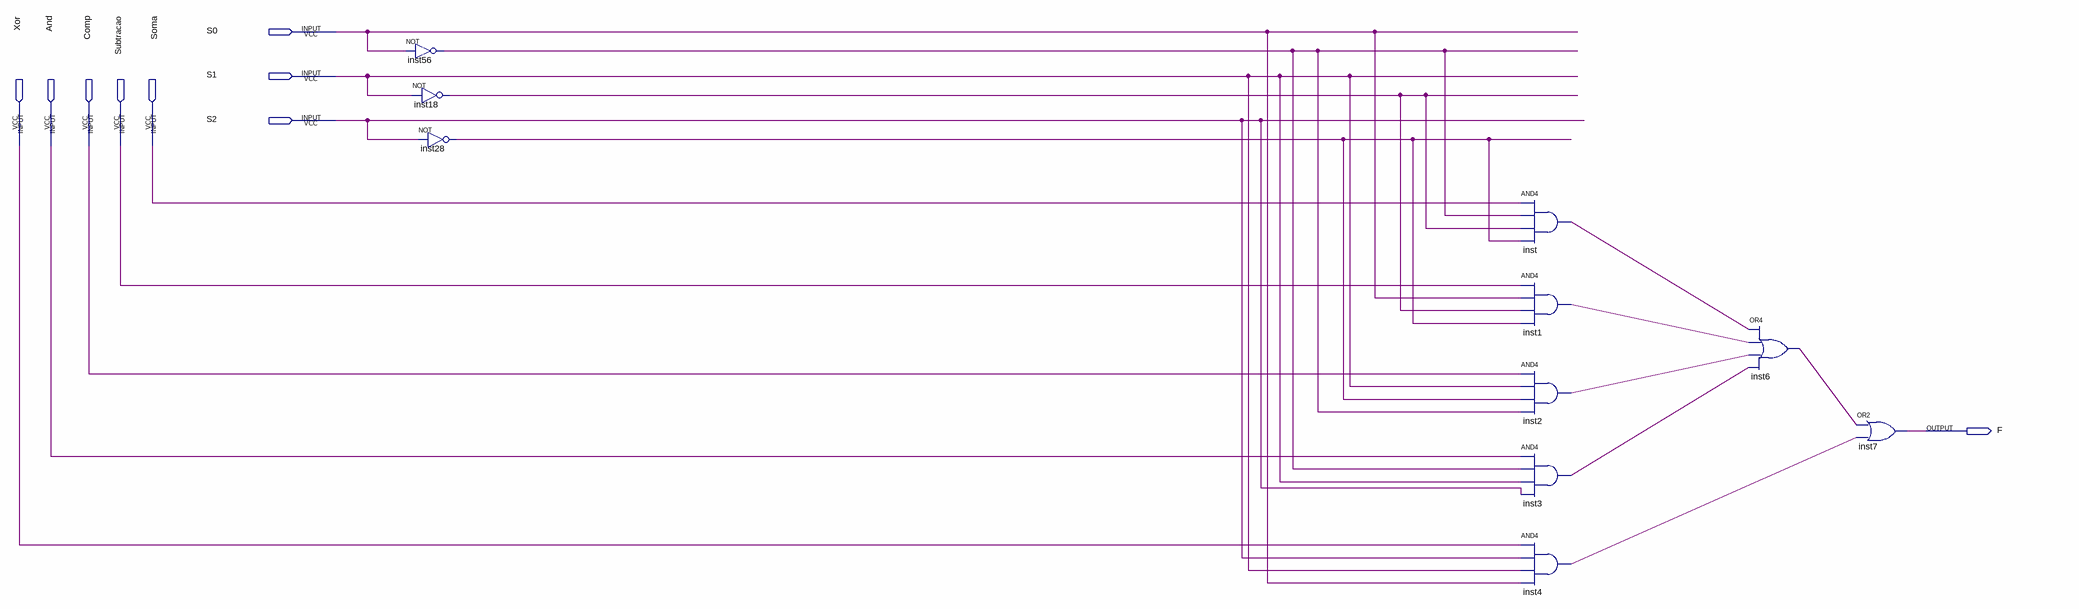
[diagram p0: schematic sheet]
// Quartus schematic Mux6bits.bdf as structural Verilog: 10 symbols, 9 pins
module Mux6bits (
  input  S0,
  input  S1,
  input  S2,
  input  Xor,
  input  And,
  input  Comp,
  input  Subtracao,
  input  Soma,
  output F
);

  wire inst1_out, inst2_out, inst3_out, inst4_out, inst6_out, inst18_out, inst28_out, inst56_out, inst_out;

  not inst56 (inst56_out, S0);
  not inst18 (inst18_out, S1);
  not inst28 (inst28_out, S2);
  and inst (inst_out, Soma, inst56_out, inst18_out, inst28_out);
  and inst1 (inst1_out, Subtracao, S0, inst18_out, inst28_out);
  and inst2 (inst2_out, Comp, S1, inst28_out, inst56_out);
  and inst3 (inst3_out, And, inst56_out, S1, S2);
  and inst4 (inst4_out, Xor, S2, S1, S0);
  or inst6 (inst6_out, inst_out, inst1_out, inst2_out, inst3_out);
  or inst7 (F, inst6_out, inst4_out);
endmodule
